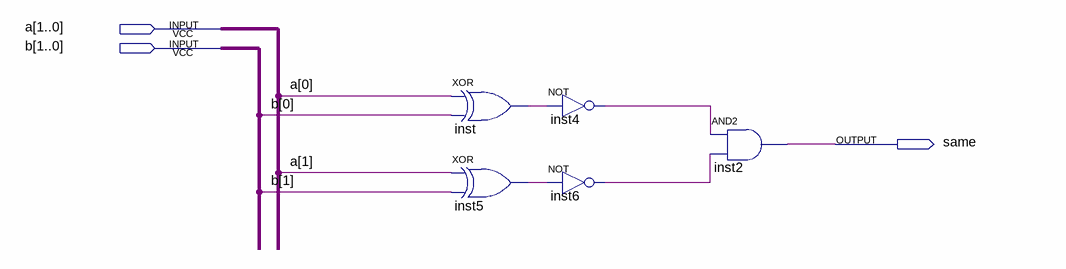
[diagram p0: schematic sheet]
// Quartus schematic Compare2bit.bdf as structural Verilog: 5 symbols, 3 pins
module Compare2bit (
  input  [1:0] a,
  input  [1:0] b,
  output same
);

  wire inst4_out, inst5_out, inst6_out, inst_out;

  xor inst (inst_out, a[0], b[0]);
  xor inst5 (inst5_out, a[1], b[1]);
  not inst4 (inst4_out, inst_out);
  not inst6 (inst6_out, inst5_out);
  and inst2 (same, inst4_out, inst6_out);
endmodule
